# EAGLE design CNY70.dev (EAGLE 9.4.2)
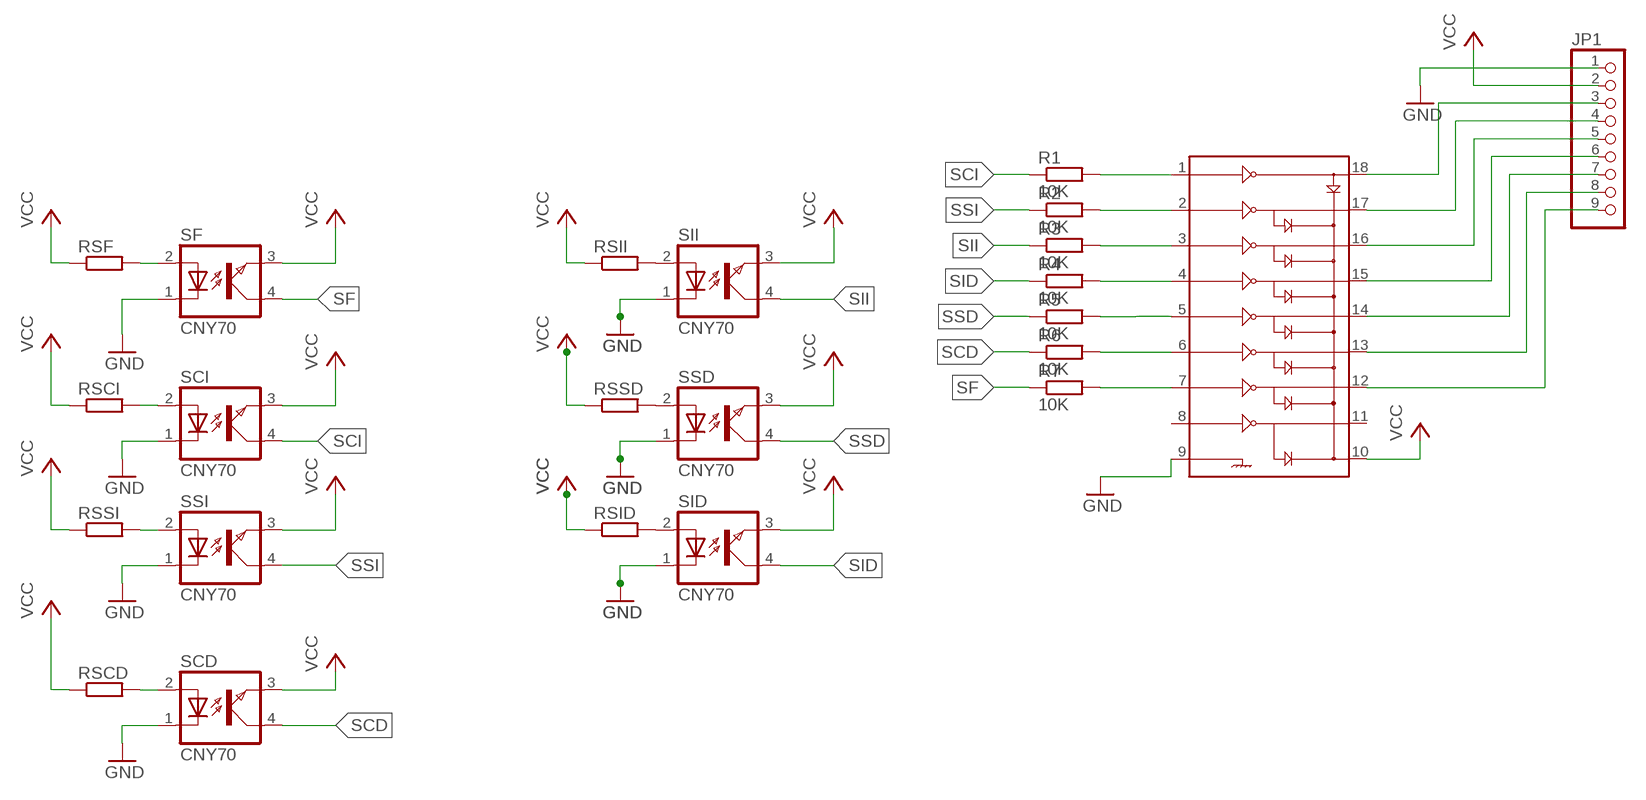
[diagram p0: schematic, sheet 1]

## Parts
JP1  PINHD-1X9/90  [1X09/90]
R1  10K  R-EU_R1206  [R1206]
R2  10K  R-EU_R1206  [R1206]
R3  10K  R-EU_R1206  [R1206]
R4  10K  R-EU_R1206  [R1206]
R5  10K  R-EU_R1206  [R1206]
R6  10K  R-EU_R1206  [R1206]
R7  10K  R-EU_R1206  [R1206]
RSCD  R-EU_R1206  [R1206]
RSCI  R-EU_R1206  [R1206]
RSF  R-EU_R1206  [R1206]
RSID  R-EU_R1206  [R1206]
RSII  R-EU_R1206  [R1206]
RSSD  R-EU_R1206  [R1206]
RSSI  R-EU_R1206  [R1206]
SCD  CNY70  [CNY70]
SCI  CNY70  [CNY70]
SF  CNY70  [CNY70]
SID  CNY70  [CNY70]
SII  CNY70  [CNY70]
SSD  CNY70  [CNY70]
SSI  CNY70  [CNY70]
ULN1  ULN2803  [DIL18]

## Nets
GND: JP1.1 SCD.1 SCI.1 SF.1 SID.1 SII.1 SSD.1 SSI.1 ULN1.9
N$1: RSII.2 SII.2
N$2: RSSD.2 SSD.2
N$3: RSID.2 SID.2
N$4: JP1.3 ULN1.18
N$5: RSCD.2 SCD.2
N$6: RSSI.2 SSI.2
N$7: RSCI.2 SCI.2
N$8: RSF.2 SF.2
N$9: JP1.4 ULN1.17
N$10: JP1.5 ULN1.16
N$11: JP1.6 ULN1.15
N$12: JP1.7 ULN1.14
N$13: JP1.8 ULN1.13
N$14: JP1.9 ULN1.12
N$18: R1.2 ULN1.1
N$19: R2.2 ULN1.2
N$20: R3.2 ULN1.3
N$21: R4.2 ULN1.4
N$22: R5.2 ULN1.5
N$23: R6.2 ULN1.6
N$24: R7.2 ULN1.7
SCD: R6.1 SCD.4
SCI: R1.1 SCI.4
SF: R7.1 SF.4
SID: R4.1 SID.4
SII: R3.1 SII.4
SSD: R5.1 SSD.4
SSI: R2.1 SSI.4
VCC: JP1.2 RSCD.1 RSCI.1 RSF.1 RSID.1 RSII.1 RSSD.1 RSSI.1 SCD.3 SCI.3 SF.3 SID.3 SII.3 SSD.3 SSI.3 ULN1.10
Unconnected: ULN1.8 ULN1.11

## Library data of the parts
JP1 = pinhead:PINHD-1X9: PIN HEADER
R1-R7 RSCD RSCI RSF RSID RSII RSSD RSSI = rcl:R-EU_: RESISTOR, European symbol; SPICEPREFIX: R
SCD SCI SF SID SII SSD SSI = EYR_Sensores:CNY70: Sensor infrarrojo CNY70
ULN1 = transistor-arrays:ULN2803: ULN2803- Darlington Array Featuring continious load ratings to 500mA for each of the drivers.

## Board
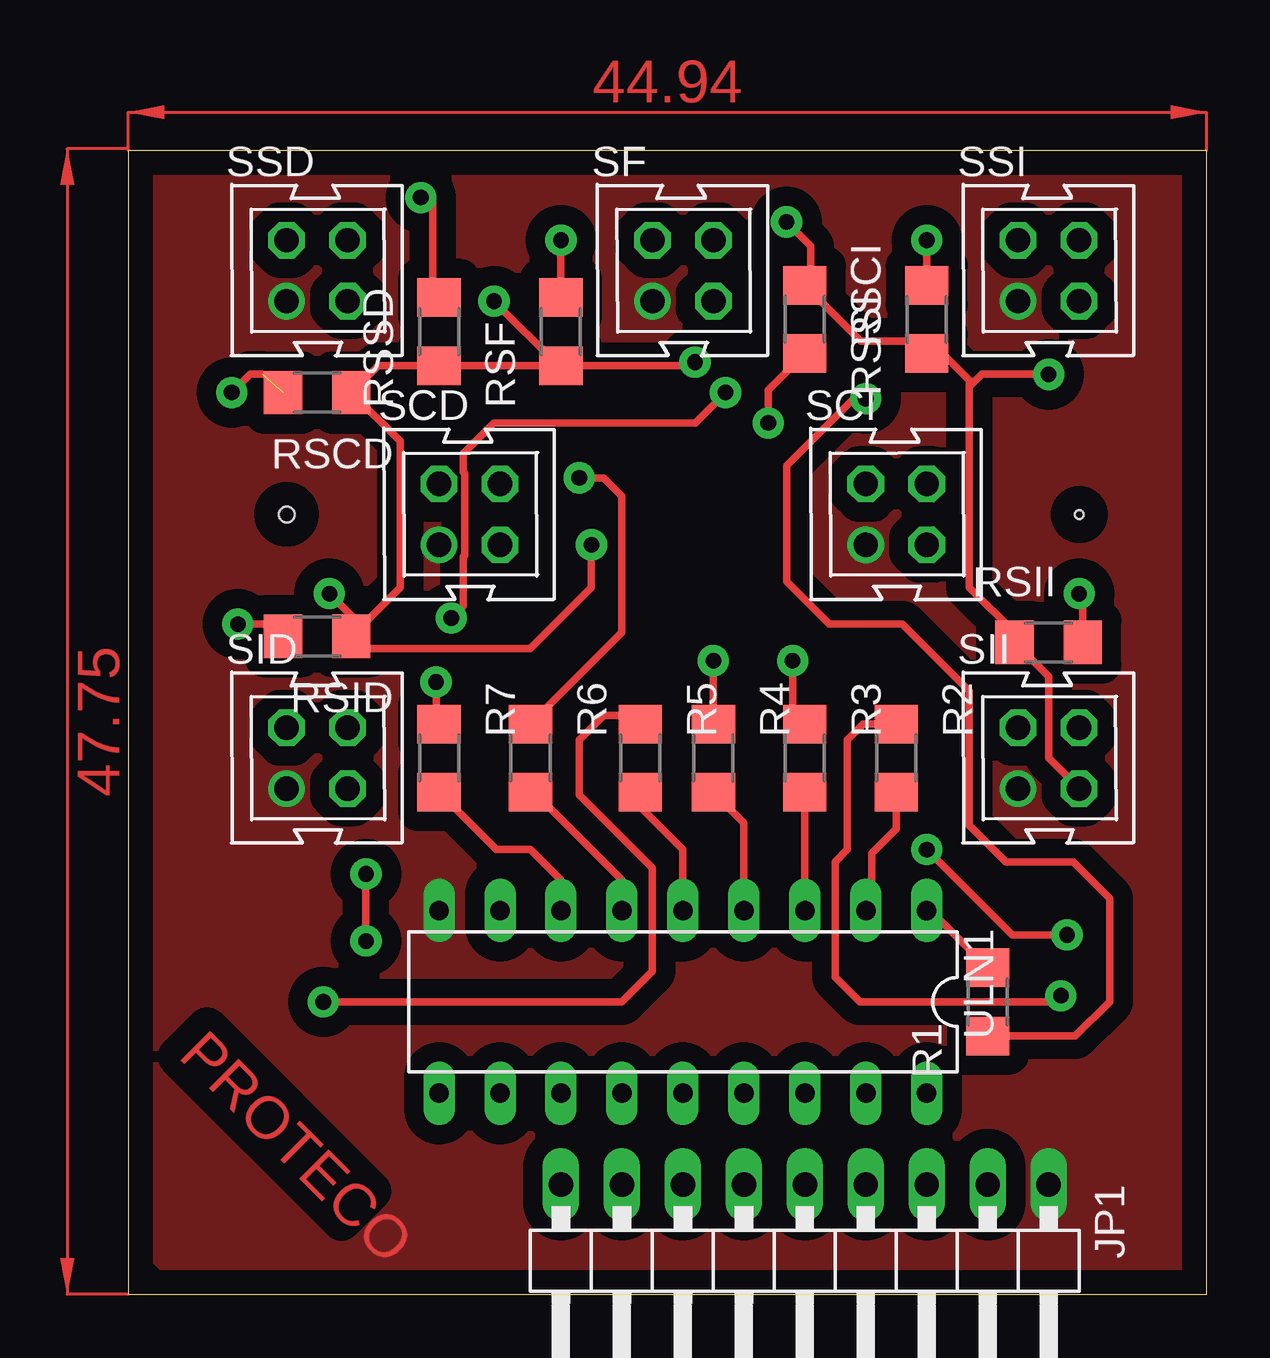
[diagram p1: board, top side]
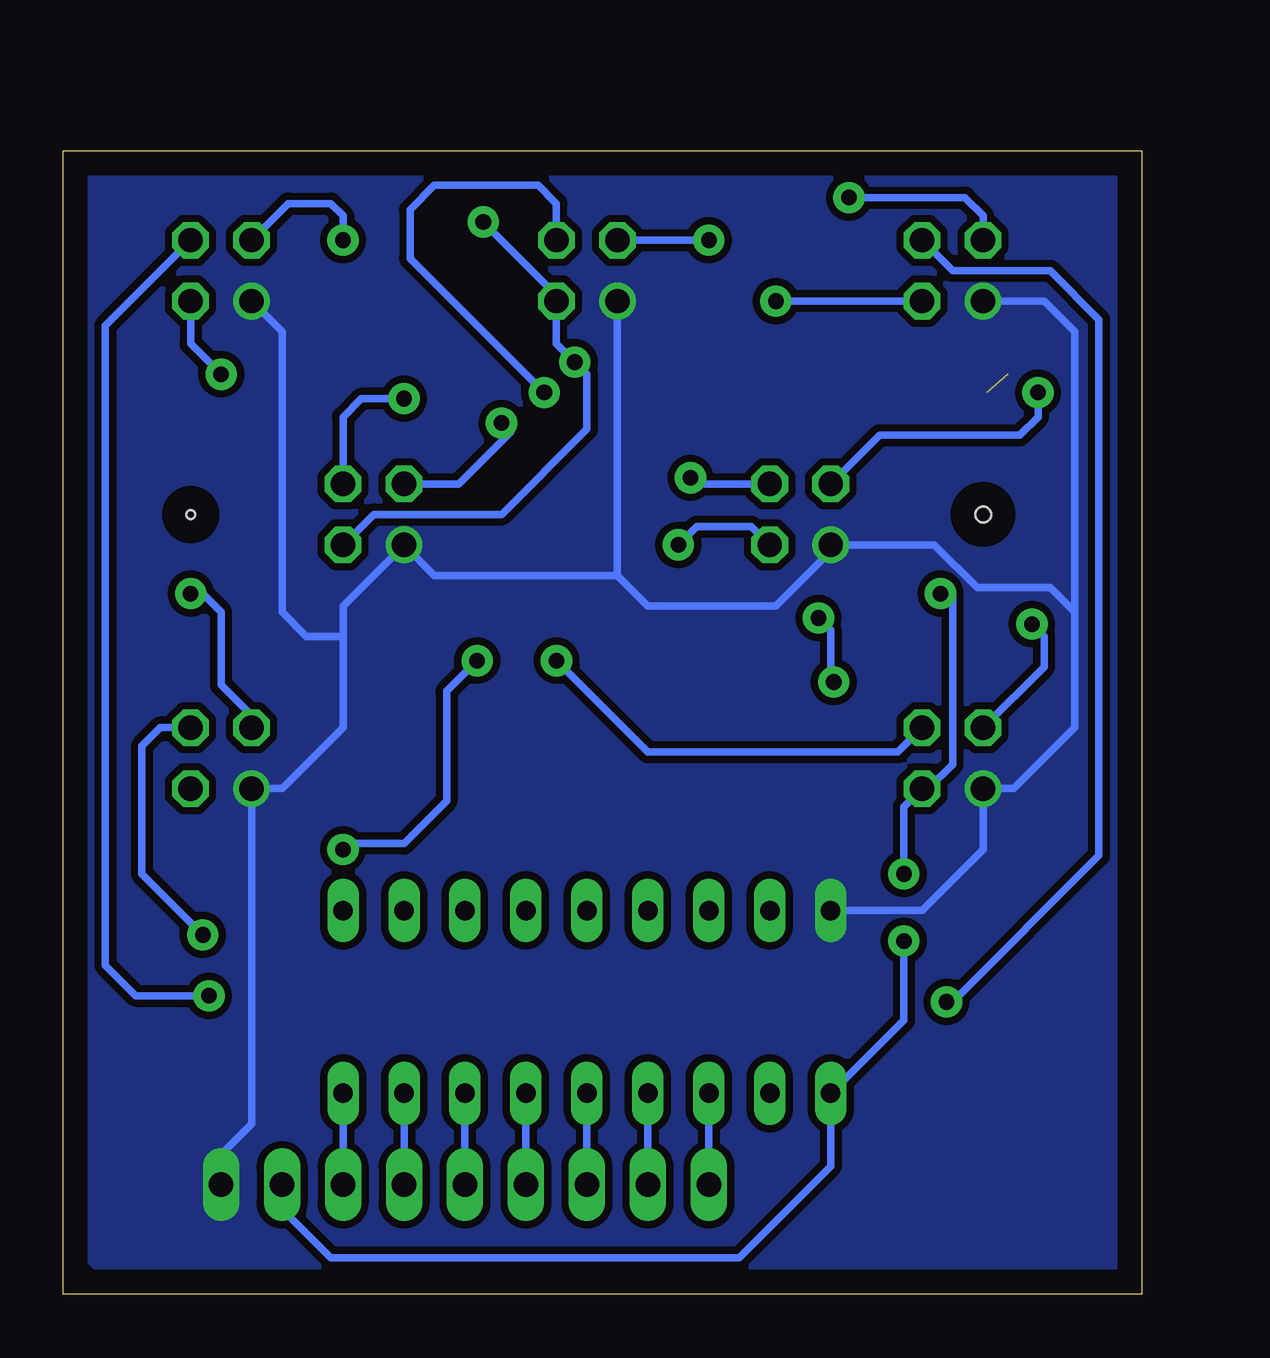
[diagram p2: board, bottom side, seen from below]

Size 44.94 x 47.68 mm. Coordinates in mm from the lower left corner, seen from the top.
Outline: 0,0 44.94,0 44.94,47.68 0,47.68 0,0
Copper layers (1*16): Top 0.035mm / dielectric 1.5mm / Bottom 0.035mm
Design rules "default": minimum track width 6mil, minimum drill 0.35mm, track to track 6mil, track to pad 6mil, pad to pad 6mil, via to via 6mil, smd to smd 6mil, copper to edge 40mil, drill to drill 6mil, minimum pad ring 10mil, minimum via ring 8mil, stop-mask expansion 4mil, vias tented up to drill 0mil, thermal gap 10mil
Holes 0.65 mm at 6.6,32.51
Holes 0.35 mm at 39.62,32.51

### Footprints (pad centres in the part's own frame; a part is rotated, then mirrored left to right if it is on the bottom)
1X09/90 = drill 1.016 long: 1 -10.16,-3.81; 2 -7.62,-3.81; 3 -5.08,-3.81; 4 -2.54,-3.81; 5 0,-3.81; 6 2.54,-3.81; 7 5.08,-3.81; 8 7.62,-3.81; 9 10.16,-3.81
R1206 = smd 1.6 x 1.803: 1 -1.422,0; 2 1.422,0
CNY70 = drill 1.016: 1 -2.54,-1.27 | drill 1.016 octagon: 2 -2.54,1.27; 3 0,-1.27; 4 0,1.27
DIL18 = drill 0.813 long: 1 -10.16,-3.81; 2 -7.62,-3.81; 3 -5.08,-3.81; 4 -2.54,-3.81; 5 0,-3.81; 6 2.54,-3.81; 7 5.08,-3.81; 8 7.62,-3.81; 9 10.16,-3.81; 10 10.16,3.81; 11 7.62,3.81; 12 5.08,3.81; 13 2.54,3.81; 14 0,3.81; 15 -2.54,3.81; 16 -5.08,3.81; 17 -7.62,3.81; 18 -10.16,3.81

### Placement (x,y rotation side)
JP1  28.19,0.76 180 top
R1  35.81,12.19 90 top
R2  32,22.35 270 top
R3  28.19,22.35 270 top
R4  24.38,22.35 270 top
R5  21.34,22.35 270 top
R6  16.76,22.35 270 top
R7  12.95,22.35 270 top
RSCD  7.87,37.59 180 top
RSCI  28.19,40.64 270 top
RSF  18.03,40.13 90 top
RSID  7.87,27.43 180 top
RSII  38.35,27.18 0 top
RSSD  12.95,40.13 90 top
RSSI  33.27,40.64 90 top
SCD  15.49,32.51 0 top
SCI  33.27,32.51 0 top
SF  24.38,42.67 0 top
SID  9.14,22.35 0 top
SII  39.62,22.35 0 top
SSD  9.14,42.67 0 top
SSI  39.62,42.67 0 top
ULN1  23.11,12.19 180 top

### Tracks (layer width: path | path; a pad name or v marks a point on that pad's centre or on a via)
GND
  Bottom 0.305: ULN1.9 9.14,16 6.6,18.54 SID.1 5.33,21.08 2.79,23.62 2.79,28.45 | 2.79,28.45 2.79,40.13 4.06,41.4 SSD.1 | SF.1 21.84,29.97 | 21.84,29.97 20.57,28.7 15.24,28.7 12.95,30.99 SCD.1 8.64,31.24 6.86,29.46 3.81,29.46 2.79,28.45 | 21.84,29.97 29.46,29.97 SCI.1 33.27,28.7 33.27,27.43 | SSI.1 35.81,40.13 35.81,28.45 34.8,27.43 33.27,27.43 | 33.27,27.43 33.27,23.62 35.81,21.08 SII.1 37.08,7.11 38.61,5.59 38.61,4.83 JP1.1 37.85,5.08
  pour Top (isolate 0.813, no thermals): 0,47.75 43.69,47.75 44.96,46.48 44.96,2.03 42.93,0 2.54,0 0,2.54
  pour Bottom (isolate 0.305, no thermals): 0,47.75 42.67,47.75 43.43,47.75 44.96,46.23 44.96,45.72 44.96,2.54 42.42,0 1.78,0 0,1.78
N$1  (via drill 0.65 pad 1.3)
  Top 0.305: v39.62,29.21 39.78,29.06 RSII.2
  Bottom 0.305: SII.2 37.08,24.13 38.35,25.4 38.35,28.45 39.12,29.21 v39.62,29.21
N$2  (via drill 0.65 pad 1.3)
  Top 0.305: RSSD.2 12.7,41.81 12.7,45.72 v12.19,45.72
  Bottom 0.305: v12.19,45.72 7.37,45.72 6.6,44.96 SSD.2
N$3  (via drill 0.65 pad 1.3)
  Top 0.305: v4.57,27.94 5.94,27.94 RSID.2
  Bottom 0.305: SID.2 4.06,26.16 4.06,27.43 v4.57,27.94
N$4
  Bottom 0.305: ULN1.18 JP1.3
N$5  (via drill 0.65 pad 1.3)  (1 unrouted)
  Top 0.305: v4.32,37.59 5.08,38.35 5.59,38.35
  Bottom 0.305: SCD.2 10.92,35.81 5.08,35.81 4.32,36.58 v4.32,37.59
N$6  (via drill 0.65 pad 1.3)
  Top 0.305: v33.27,43.94 RSSI.2
  Bottom 0.305: SSI.2 35.56,45.47 33.78,45.47 33.27,44.96 v33.27,43.94
N$7  (via drill 0.65 pad 1.3)
  Top 0.305: v26.67,36.32 26.67,37.69 RSCI.2
  Bottom 0.305: SCI.2 28.45,33.78 26.29,35.94 v26.67,36.32
N$8  (via drill 0.65 pad 1.3)
  Top 0.305: v18.03,43.94 RSF.2
  Bottom 0.305: SF.2 v18.03,43.94
N$9
  Bottom 0.305: ULN1.17 JP1.4
N$10
  Bottom 0.305: ULN1.16 JP1.5
N$11
  Bottom 0.305: ULN1.15 JP1.6
N$12
  Bottom 0.305: ULN1.14 JP1.7
N$13
  Bottom 0.305: ULN1.13 JP1.8
N$14
  Bottom 0.305: ULN1.12 JP1.9
N$18
  Top 0.305: ULN1.1 33.43,16 R1.2
N$19
  Top 0.305: ULN1.2 30.99,16.26 30.99,18.39 32,19.41 R2.2
N$20
  Top 0.305: ULN1.3 R3.2
N$21
  Top 0.305: ULN1.4 25.65,19.66 R4.2
N$22
  Top 0.305: ULN1.5 23.11,18.54 20.73,20.93 R5.2
N$23
  Top 0.305: ULN1.6 20.57,17.27 16.92,20.93 R6.2
N$24
  Top 0.305: ULN1.7 18.03,17.27 16.76,18.54 15.34,18.54 R7.2
SCD  (via drill 0.65 pad 1.3)
  Top 0.305: R6.1 20.57,27.58 20.57,33.27 19.81,34.04 v18.8,34.04
  Bottom 0.305: v18.8,34.04 18.54,33.78 SCD.4
SCI  (via drill 0.65 pad 1.3)
  Top 0.305: R1.1 39.47,10.77 40.89,12.19 40.89,16.51 39.37,18.03 36.58,18.03 35.05,19.56 35.05,25.15 32.26,27.94 29.21,27.94 27.43,29.72 27.43,34.54 30.23,37.34 v30.73,37.34
  Bottom 0.305: v30.73,37.34 32.51,37.34 33.27,36.58 SCI.4
SF  (via drill 0.65 pad 1.3)
  Top 0.305: v24.89,37.59 23.62,36.32 15.24,36.32 13.97,35.05 13.97,34.27 14.02,34.22 14.02,30.8 13.97,30.75 13.97,28.7 v13.46,28.19 | v12.83,25.53 12.83,23.9 R7.1
  Bottom 0.305: SF.4 24.38,45.47 25.15,46.23 29.46,46.23 30.48,45.21 30.48,43.18 v24.89,37.59 | v13.46,28.19 12.95,27.69 12.95,25.91 13.34,25.53 v12.83,25.53
SID  (via drill 0.65 pad 1.3)
  Top 0.305: R4.1 v24.38,26.42
  Bottom 0.305: v24.38,26.42 20.57,22.61 10.16,22.61 SID.4
SII  (via drill 0.65 pad 1.3)
  Top 0.305: R3.1 27.69,24.28 v27.69,26.42 | v33.27,18.54 36.83,14.99 v39.12,14.99
  Bottom 0.305: SII.4 40.89,23.62 41.66,22.86 41.66,17.53 v39.12,14.99 | v27.69,26.42 28.96,25.15 28.96,20.57 30.73,18.8 33.27,18.8 v33.27,18.54
SSD  (via drill 0.65 pad 1.3)
  Top 0.305: v8.13,12.19 20.57,12.19 21.84,13.46 21.84,17.78 18.8,20.83 18.8,23.11 19.81,24.13 20.98,24.13 R5.1
  Bottom 0.305: SSD.4 7.87,42.67 3.81,42.67 1.78,40.64 1.78,18.29 7.87,12.19 v8.13,12.19
SSI  (via drill 0.65 pad 1.3)
  Top 0.305: v38.86,12.45 38.61,12.19 30.48,12.19 29.46,13.21 29.46,18.03 29.97,18.54 29.97,23.11 30.63,23.77 R2.1
  Bottom 0.305: SSI.4 43.18,40.39 43.18,13.72 41.91,12.45 v38.86,12.45
VCC  (via drill 0.65 pad 1.3)
  Top 0.305: v27.43,44.7 28.45,43.69 28.45,42.32 RSCI.1 30.53,39.73 32.77,39.73 RSSI.1 33.93,39.22 35.05,38.1 35.05,37.85 | 17.93,38.71 RSSD.1 10.41,38.71 RSCD.1 11.33,35.56 11.33,29.46 9.73,27.86 | 17.93,38.71 RSF.1 23.47,38.71 v23.62,38.86 | 9.73,27.86 RSID.1 9.8,26.92 16.76,26.92 19.3,29.46 v19.3,31.24 | 35.05,37.85 35.05,29.46 36.93,27.58 RSII.1 38.35,25.76 38.35,22.35 SII.3 | 17.93,38.71 v15.24,41.4 | v38.35,38.35 35.56,38.35 35.05,37.85 | v8.38,29.21 9.73,27.86 | v9.91,17.53 v9.91,14.73
  Bottom 0.305: v27.43,44.7 24.38,41.66 SF.3 24.38,39.62 v23.62,38.86 23.11,38.35 23.11,36.07 26.67,32.51 32,32.51 SCI.3 | v19.3,31.24 18.54,32 16.26,32 SCD.3 | SSD.3 v15.24,41.4 | SSI.3 39.62,39.62 v38.35,38.35 | v8.38,29.21 7.87,29.21 7.87,22.1 8.89,21.08 SID.3 9.91,20.32 v9.91,17.53 | v9.91,14.73 9.91,11.43 ULN1.10 12.95,5.33 16.76,1.52 33.78,1.52 35.81,3.56 JP1.2
(copper drawn outside any net)
  shapes: Top area x2

### Text on the board
Top: PROTECO